# EAGLE schematic PowerBricksBoard1 (EAGLE 9.5.0)
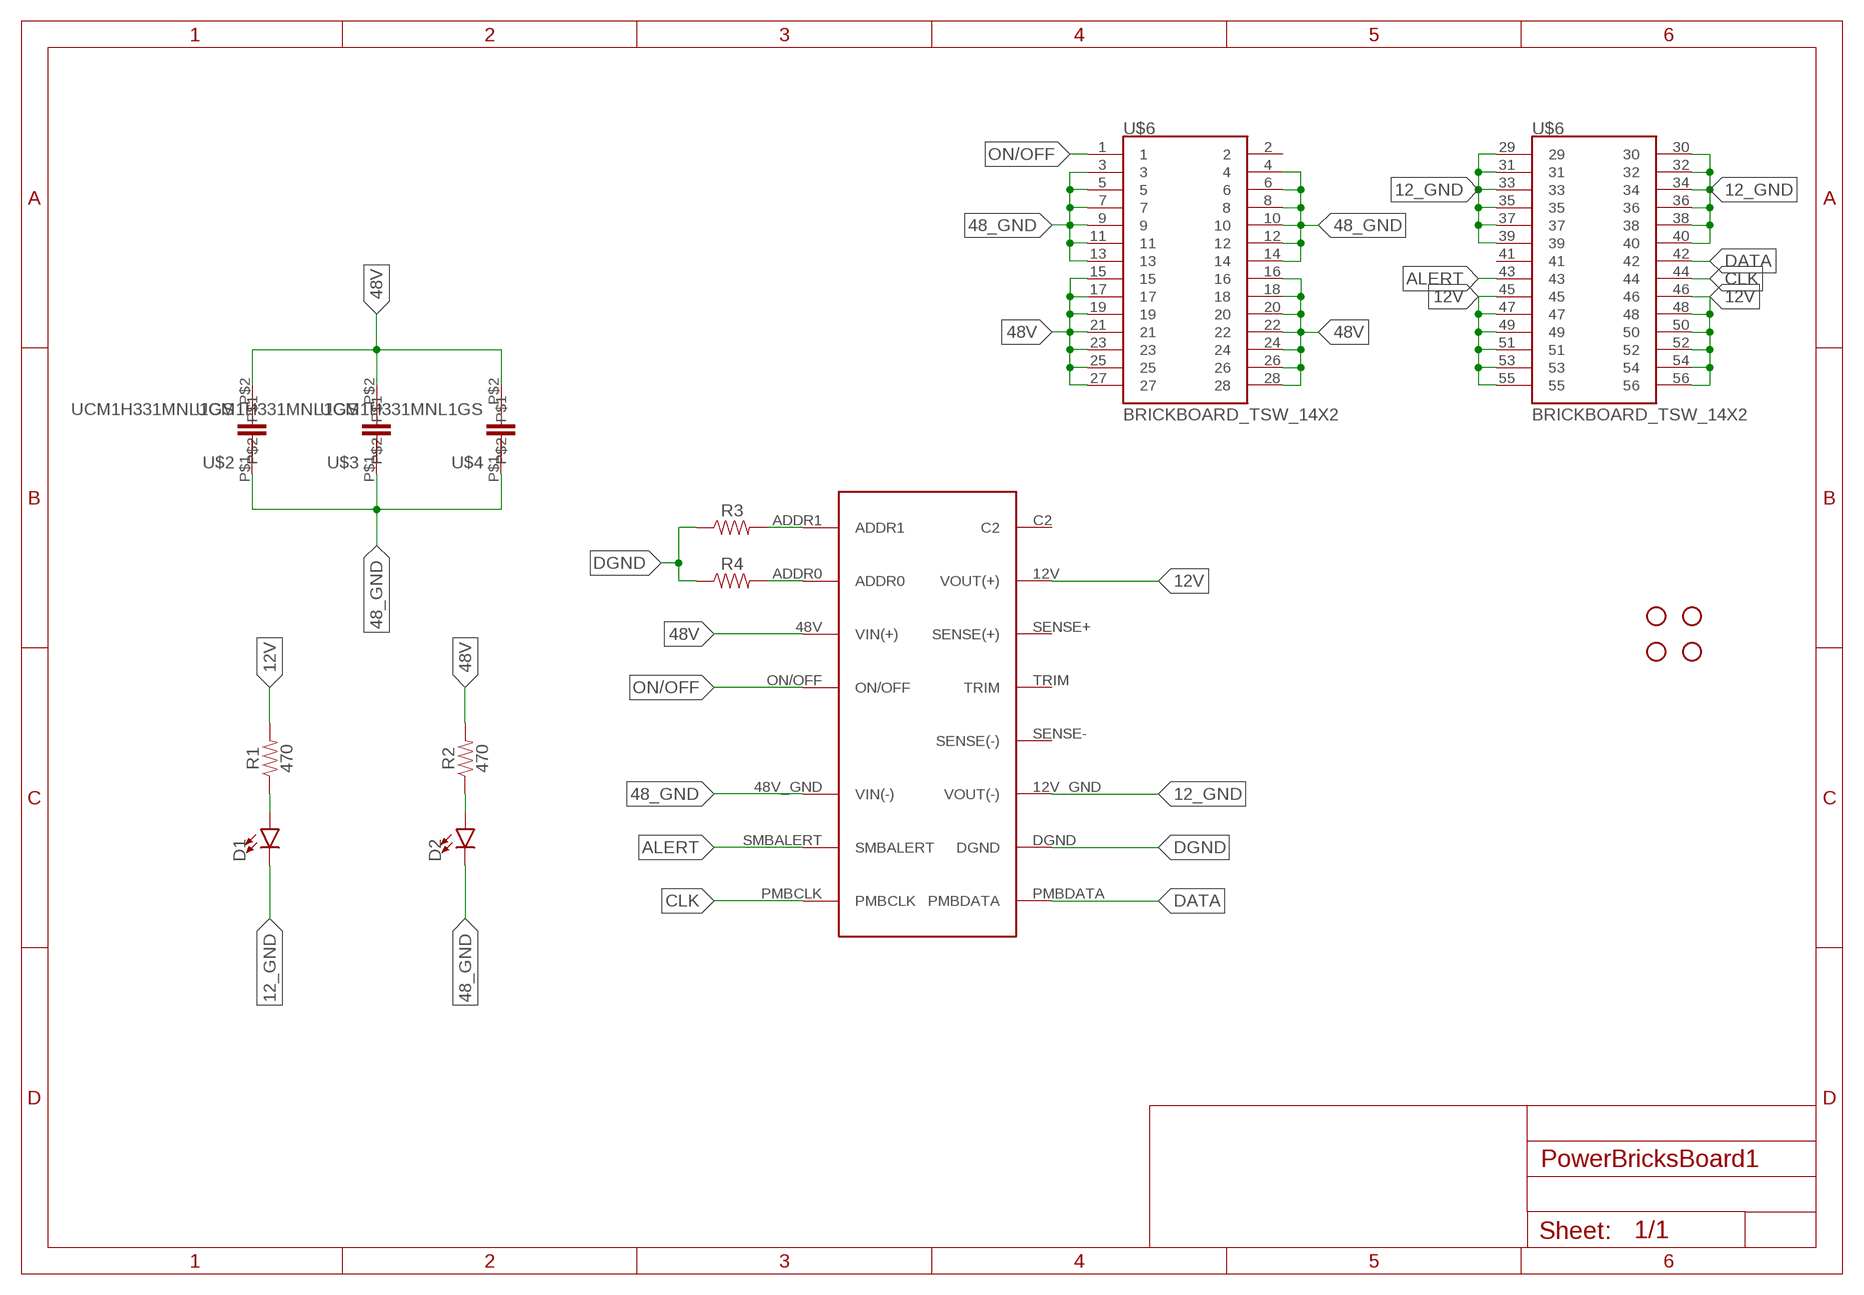
[diagram p0: schematic, sheet 1]

## Parts
D1  LED0603  [LED-0603]
D2  LED0603  [LED-0603]
H1  STAND-OFF  [STAND-OFF]
H2  STAND-OFF  [STAND-OFF]
H3  STAND-OFF  [STAND-OFF]
H4  STAND-OFF  [STAND-OFF]
R1  470  RESISTOR0603  [0603]
R2  470  RESISTOR0603  [0603]
R3  RESISTOR0603  [0603]
R4  RESISTOR0603  [0603]
U$1  Q48SC12050NRDH  [Q48SC12050NRDH]
U$2  UCM1H331MNL1GS  [UCM1H331MNL1GS]
U$3  UCM1H331MNL1GS  [UCM1H331MNL1GS]
U$4  UCM1H331MNL1GS  [UCM1H331MNL1GS]
U$6  BRICKBOARD_TSW_14X2  [BRICKBOARD_TSW_14X2]

## Nets
12_GND: D1.C U$1.12V_GND(VOUT(-)) U$6.29 U$6.30 U$6.31 U$6.32 U$6.33 U$6.34 U$6.35 U$6.36 U$6.37 U$6.38 U$6.39 U$6.40
12V: R1.2 U$1.12V(VOUT(+)) U$6.45 U$6.46 U$6.47 U$6.48 U$6.49 U$6.50 U$6.51 U$6.52 U$6.53 U$6.54 U$6.55 U$6.56
48_GND: D2.C U$1.48V_GND(VIN(-)) U$2.P$1 U$3.P$1 U$4.P$1 U$6.3 U$6.4 U$6.5 U$6.6 U$6.7 U$6.8 U$6.9 U$6.10 U$6.11 U$6.12 U$6.13 U$6.14
48V: R2.2 U$1.48V(VIN(+)) U$2.P$2 U$3.P$2 U$4.P$2 U$6.15 U$6.16 U$6.17 U$6.18 U$6.19 U$6.20 U$6.21 U$6.22 U$6.23 U$6.24 U$6.25 U$6.26 U$6.27 U$6.28
ALERT: U$1.SMBALERT U$6.43
CLK: U$1.PMBCLK U$6.44
DATA: U$1.PMBDATA U$6.42
DGND: R3.1 R4.1 U$1.DGND
N$1: D1.A R1.1
N$2: D2.A R2.1
N$3: R3.2 U$1.ADDR1
N$4: R4.2 U$1.ADDR0
ON/OFF: U$1.ON/OFF U$6.1
Unconnected: U$1.C2 U$1.SENSE+(SENSE(+)) U$1.SENSE-(SENSE(-)) U$1.TRIM U$6.2 U$6.41

## Library data of the parts
D1 D2 = SparkFun-LED:LED: LED (Generic) Standard schematic elements and footprints for 5mm, 3mm, 1206, and 0603 sized LEDs. Generic LEDs with no color specified.
H1-H4 = SparkFun-Hardware:STAND-OFF: Stand Off Drill holes for mechanically mounting via screws, standoffs, etc. Note: Use the keepout ring to avoid running the screw head into surrounding components. Variant Overviews STAND-OFF - Mechanical footprint for a #4 phillips button head screw. STAND-OFF-TIGHT - Mechanical footprint for a #4 phillips button head screw, Example SparkFun Products Screw - Phillips Head (1/4", 4-40, 10 pack) <https://www.sparkfun.com/products/10453> (PRT-10453) Screw - Phillips Head (1/2", 4-40, 10 pack) <https://www.sparkfun.com/products/10452> (PRT-10452) Screw - Phillips Head (3/4", 4-40, 10 pack) <https://www.sparkfun.com/products/10451> (PRT-10451) Screw - Phillips Head (1", 4-40, 10 pack) <https://www.sparkfun.com/products/10450> (PRT-10450)
R1-R4 = SparkFun-Resistors:RESISTOR: Generic Resistor Package
U$1 = Q48SC12050NRDH:Q48SC12050NRDH
U$2-U$4 = UCM1H331MNL1GS:UCM1H331MNL1GS
U$6 = Dist_to_Brickboard_Connector_brick:BRICKBOARD_TSW_14X2